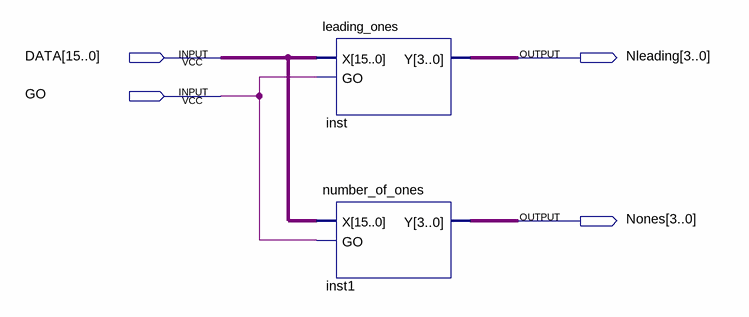
[diagram p0: schematic sheet]
// Quartus schematic behavioural.bdf as structural Verilog: 2 symbols, 4 pins
module behavioural (
  input  [15:0] DATA,
  input  GO,
  output [3:0] Nleading,
  output [3:0] Nones
);

  leading_ones inst (.X(DATA), .GO(GO), .Y(Nleading));
  number_of_ones inst1 (.X(DATA), .GO(GO), .Y(Nones));
endmodule
